# EAGLE design GateRhythm (EAGLE 6.5.0)
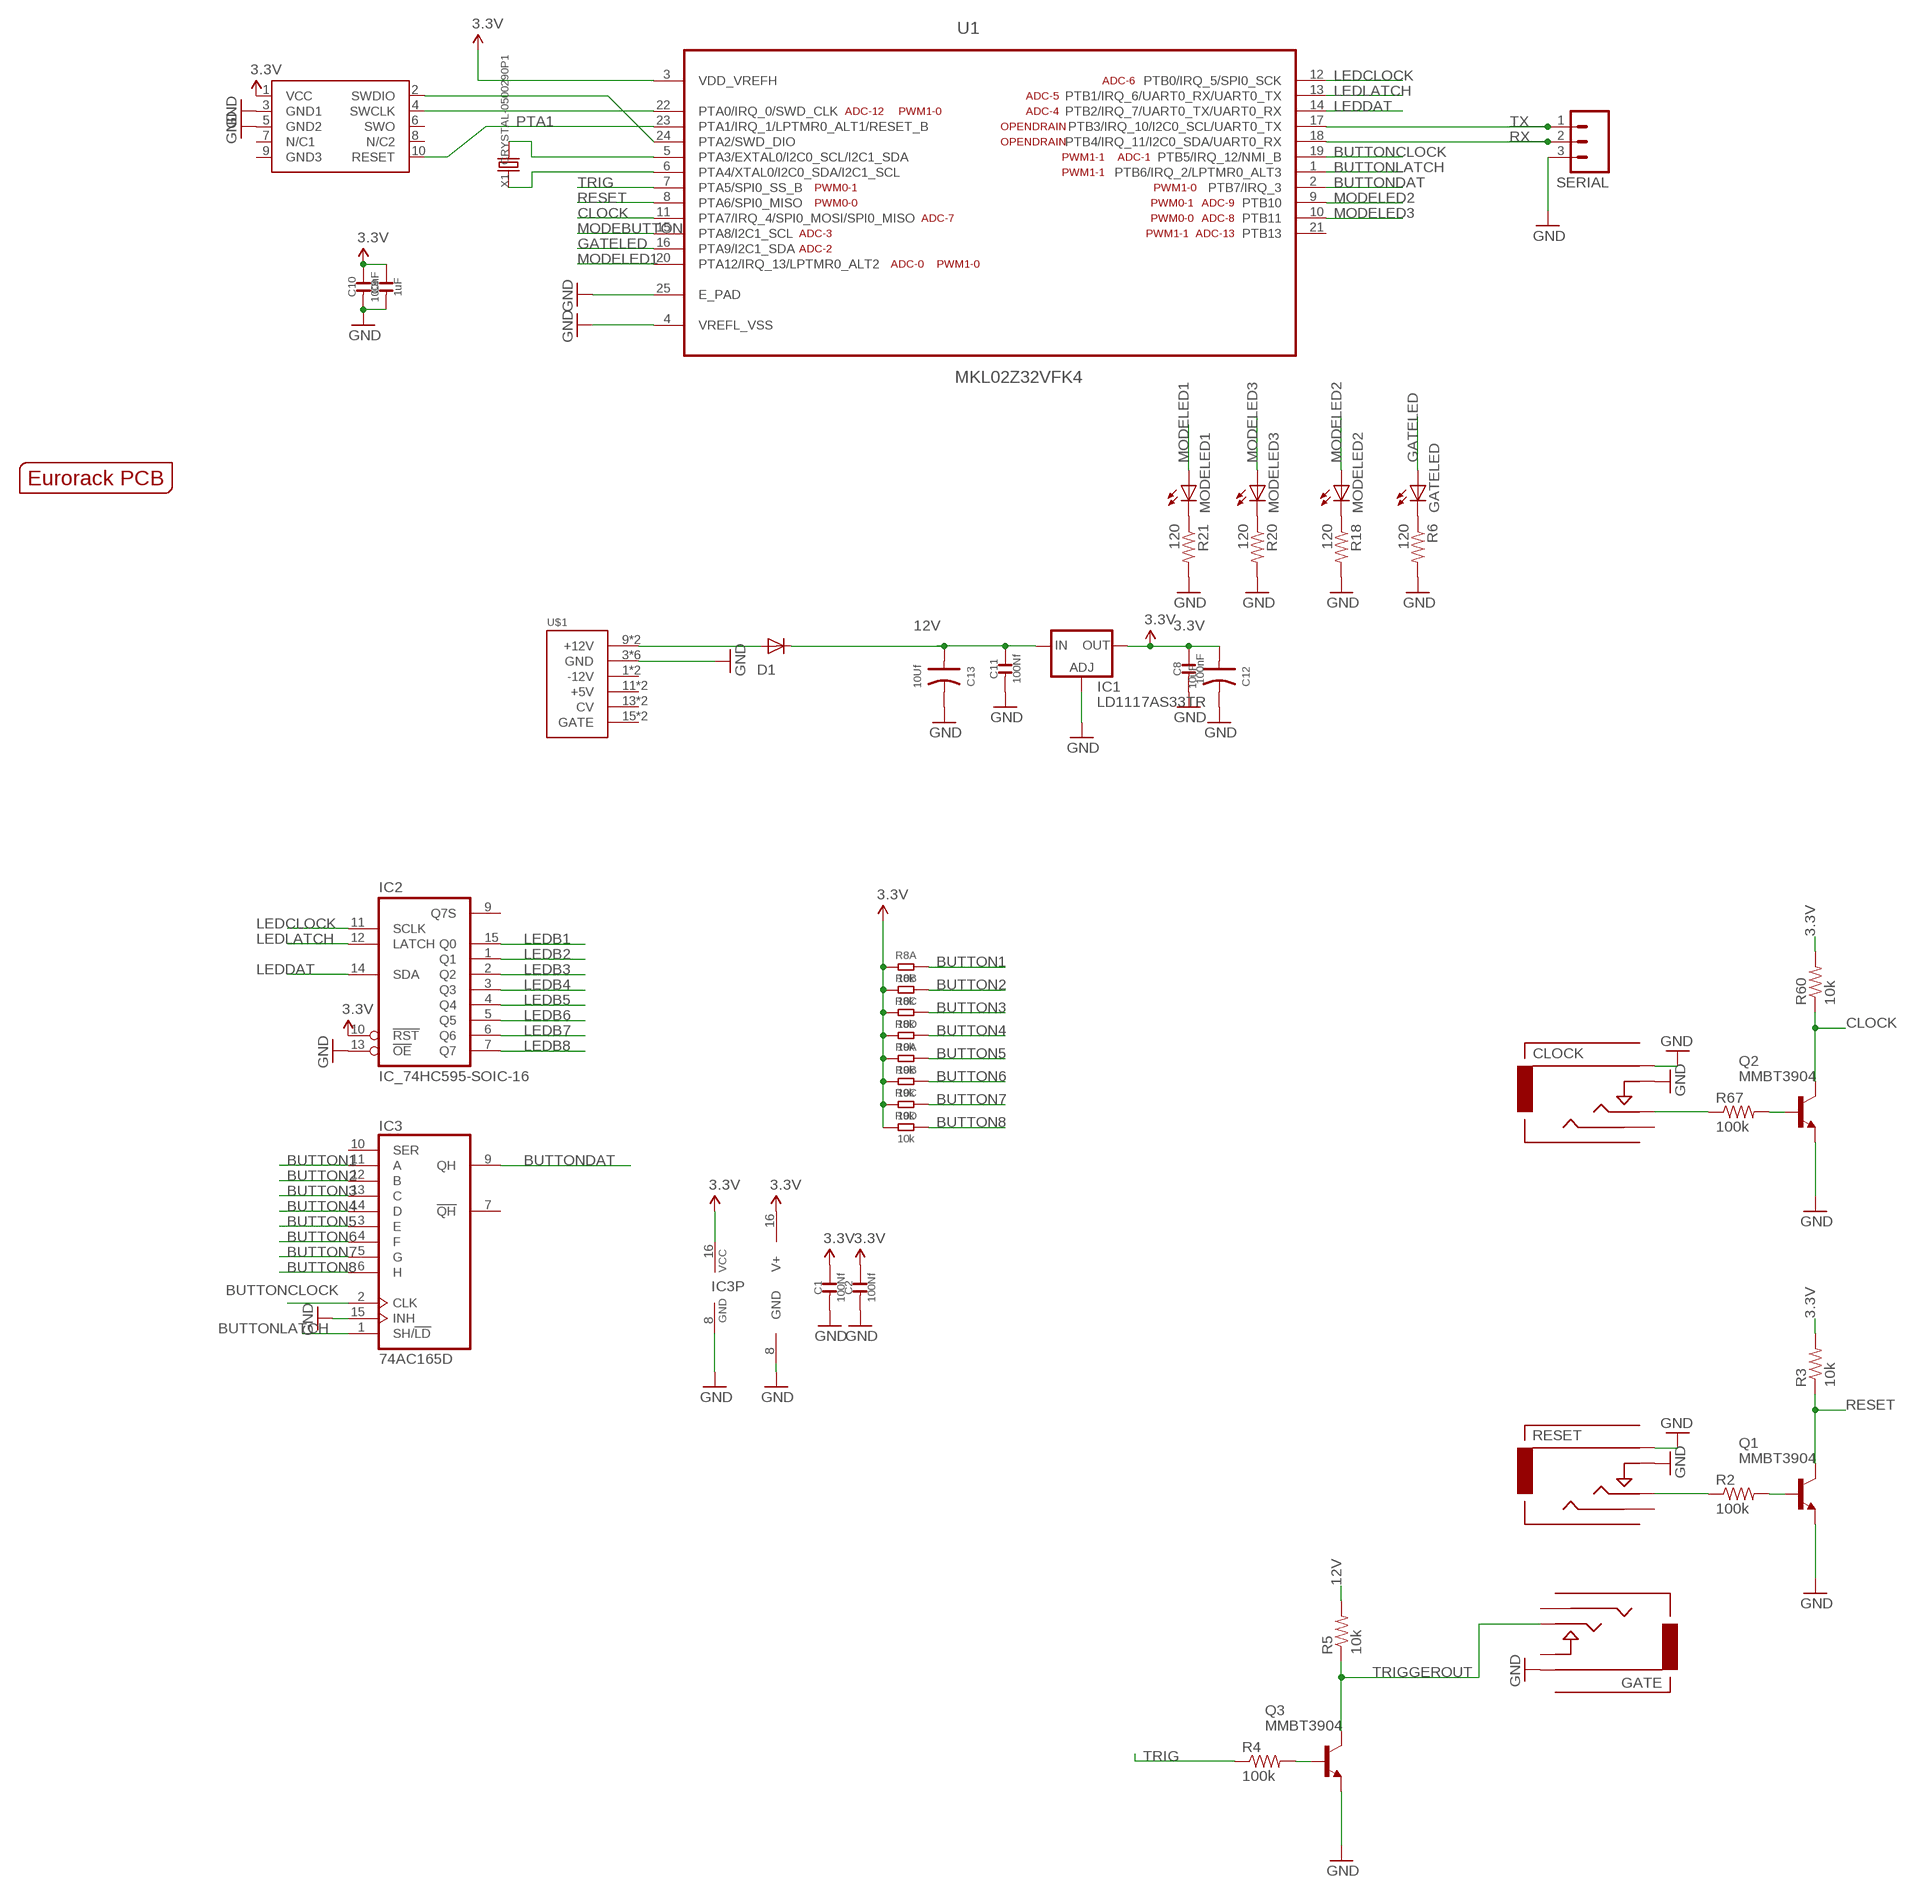
[diagram p0: schematic, sheet 1, part 1 of 2]
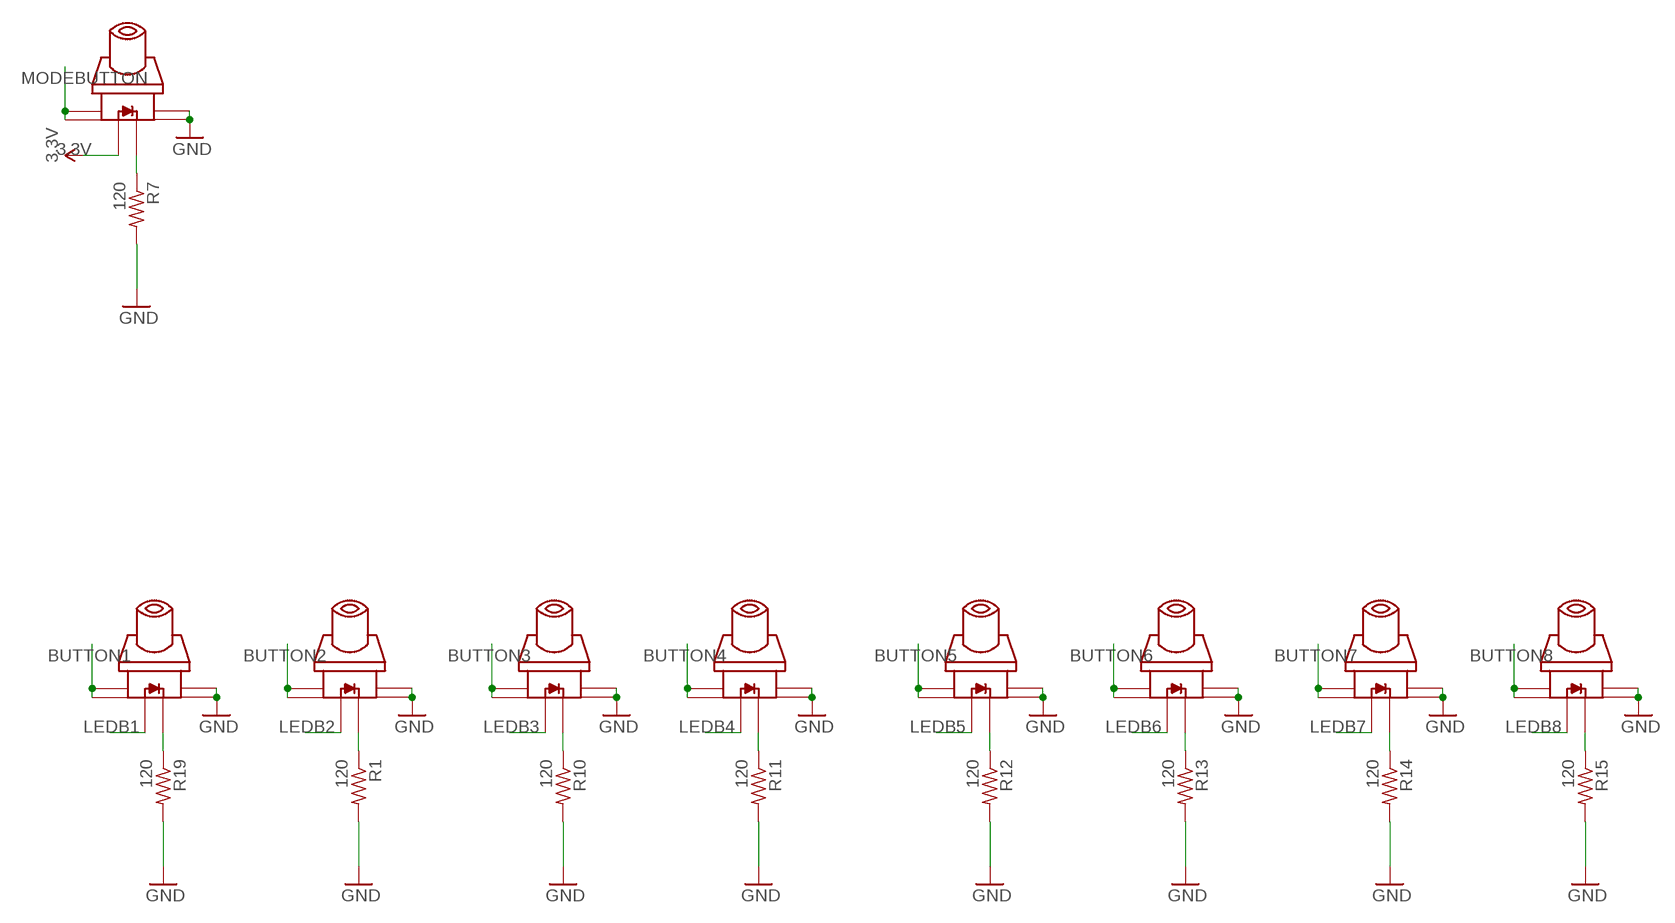
[diagram p1: schematic, sheet 1, part 2 of 2]

## Parts
B1  SWITCH_W_LED_PB6149L-X-102WHITE  [PB6149L]
B2  SWITCH_W_LED_PB6149L-X-102WHITE  [PB6149L]
B3  SWITCH_W_LED_PB6149L-X-102WHITE  [PB6149L]
B4  SWITCH_W_LED_PB6149L-X-102WHITE  [PB6149L]
B5  SWITCH_W_LED_PB6149L-X-102WHITE  [PB6149L]
B6  SWITCH_W_LED_PB6149L-X-102WHITE  [PB6149L]
B7  SWITCH_W_LED_PB6149L-X-102WHITE  [PB6149L]
B8  SWITCH_W_LED_PB6149L-X-102WHITE  [PB6149L]
B9  SWITCH_W_LED_PB6149L-X-102WHITE  [PB6149L]
C1  100Nf  C-0603  [C0603]
C2  100Nf  C-0603  [C0603]
C8  100nF  C-0603  [C0603]
C9  1uF  C-0603  [C0603]
C10  100nF  C-0603  [C0603]
C11  100Nf  C-0603  [C0603]
C12  10uF  C-POLAR-A  [AVX-A]
C13  10Uf  C-POLAR-A  [AVX-A]
CLOCK  Clock  AUDIO-JACKINPUT  [3.5MM-JACK-SWITCH-13MM-INPUT]
D1  1N5819HW  DIODE-SOD123  [SOD123]
GATE  Gate  AUDIO-JACKOUTPUT  [3.5MM-JACK-SWITCH-13MM-OUTPUT]
GATELED  LED3MM  [LED3MM]
IC1  LD1117AS33TR  [SOT223]
IC2  IC_74HC595-SOIC-16  [SOIC-16]
IC3  74AC165D  [SO16]
MODELED1  LED3MM  [LED3MM]
MODELED2  LED3MM  [LED3MM]
MODELED3  LED3MM  [LED3MM]
Q1  MMBT3904  MMBT3904LT1-NPN-SOT23-BEC  [SOT23-BEC]
Q2  MMBT3904  MMBT3904LT1-NPN-SOT23-BEC  [SOT23-BEC]
Q3  MMBT3904  MMBT3904LT1-NPN-SOT23-BEC  [SOT23-BEC]
R1  120  R-US_R0603  [R0603]
R2  100k  R-US_R0603  [R0603]
R3  10k  R-US_R0603  [R0603]
R4  100k  R-US_R0603  [R0603]
R5  10k  R-US_R0603  [R0603]
R6  120  R-US_R0603  [R0603]
R7  120  R-US_R0603  [R0603]
R8  10k  R-4R  [R1206-8]
R9  10k  R-4R  [R1206-8]
R10  120  R-US_R0603  [R0603]
R11  120  R-US_R0603  [R0603]
R12  120  R-US_R0603  [R0603]
R13  120  R-US_R0603  [R0603]
R14  120  R-US_R0603  [R0603]
R15  120  R-US_R0603  [R0603]
R18  120  R-US_R0603  [R0603]
R19  120  R-US_R0603  [R0603]
R20  120  R-US_R0603  [R0603]
R21  120  R-US_R0603  [R0603]
R60  10k  R-US_R0603  [R0603]
R67  100k  R-US_R0603  [R0603]
RESET  Reset  AUDIO-JACKINPUT  [3.5MM-JACK-SWITCH-13MM-INPUT]
SERIAL  M03PTH  [1X03]
SWD1  CORTEX_SWD  [M50-3600542]
U1  MKL02Z32VFK4  [QFN50P400X400X100-25N]
U$1  POWER  [POWER_16]
U$2  EURORACK_PCB6HP  [EURORACK6HPPCB]
X1  CRYSTAL-0500290P1  [2P-SMD-5.0X3.2]

## Nets
3.3V: B9.LEDPOS(POS) C1.2 C2.2 C8.2 C9.2 C10.2 C12.+ IC1.2(OUT) IC1.4(OUT) IC2.10(!RST) IC2.16(V+) IC3.16(VCC) R3.2 R8.1 R8.2 R8.3 R8.4 R9.1 R9.2 R9.3 R9.4 R60.2 SWD1.1(VCC) U1.3(VDD_VREFH)
12V: C11.2 C13.+ D1.C IC1.3(IN) R5.2
BUTTON1: B1.1 B1.2 IC3.11(A) R8.8
BUTTON2: B2.1 B2.2 IC3.12(B) R8.7
BUTTON3: B3.1 B3.2 IC3.13(C) R8.6
BUTTON4: B4.1 B4.2 IC3.14(D) R8.5
BUTTON5: B5.1 B5.2 IC3.3(E) R9.8
BUTTON6: B6.1 B6.2 IC3.4(F) R9.7
BUTTON7: B7.1 B7.2 IC3.5(G) R9.6
BUTTON8: B8.1 B8.2 IC3.6(H) R9.5
BUTTONCLOCK: IC3.2(CLK) U1.19(PTB5/IRQ_12/NMI_B)
BUTTONDAT: IC3.9(QH) U1.2(PTB7/IRQ_3)
BUTTONLATCH: IC3.1(SH/!LD) U1.1(PTB6/IRQ_2/LPTMR0_ALT3)
CLOCK: Q2.C R60.1 U1.11(PTA7/IRQ_4/SPI0_MOSI/SPI0_MISO)
GATELED: GATELED.A U1.16(PTA9/I2C1_SDA)
GND: B1.3 B1.4 B2.3 B2.4 B3.3 B3.4 B4.3 B4.4 B5.3 B5.4 B6.3 B6.4 B7.3 B7.4 B8.3 B8.4 B9.3 B9.4 C1.1 C2.1 C8.1 C9.1 C10.1 C11.1 C12.- C13.- CLOCK.RING@1(RING) CLOCK.RING@2(RING) CLOCK.SWITCH@1(SWITCH) CLOCK.SWITCH@2(SWITCH) GATE.RING@1(RING) GATE.RING@2(RING) IC1.1(ADJ) IC2.8(GND) IC2.13(!OE) IC3.8(GND) IC3.15(INH) Q1.E Q2.E Q3.E R1.2 R6.2 R7.2 R10.2 R11.2 R12.2 R13.2 R14.2 R15.2 R18.2 R19.2 R20.2 R21.2 RESET.RING@1(RING) RESET.RING@2(RING) RESET.SWITCH@1(SWITCH) RESET.SWITCH@2(SWITCH) SERIAL.3 SWD1.3(GND1) SWD1.5(GND2) U1.4(VREFL_VSS) U1.25(E_PAD) U$1.3(GND) U$1.4(GND) U$1.5(GND) U$1.6(GND) U$1.7(GND) U$1.8(GND)
LEDB1: B1.LEDPOS(POS) IC2.15(Q0)
LEDB2: B2.LEDPOS(POS) IC2.1(Q1)
LEDB3: B3.LEDPOS(POS) IC2.2(Q2)
LEDB4: B4.LEDPOS(POS) IC2.3(Q3)
LEDB5: B5.LEDPOS(POS) IC2.4(Q4)
LEDB6: B6.LEDPOS(POS) IC2.5(Q5)
LEDB7: B7.LEDPOS(POS) IC2.6(Q6)
LEDB8: B8.LEDPOS(POS) IC2.7(Q7)
LEDCLOCK: IC2.11(SCLK) U1.12(PTB0/IRQ_5/SPI0_SCK)
LEDDAT: IC2.14(SDA) U1.14(PTB2/IRQ_7/UART0_TX/UART0_RX)
LEDLATCH: IC2.12(LATCH) U1.13(PTB1/IRQ_6/UART0_RX/UART0_TX)
MODEBUTTON: B9.1 B9.2 U1.15(PTA8/I2C1_SCL)
MODELED1: MODELED1.A U1.20(PTA12/IRQ_13/LPTMR0_ALT2)
MODELED2: MODELED2.A U1.9(PTB10)
MODELED3: MODELED3.A U1.10(PTB11)
N$1: U1.5(PTA3/EXTAL0/I2C0_SCL/I2C1_SDA) X1.2
N$2: U1.6(PTA4/XTAL0/I2C0_SDA/I2C1_SCL) X1.1
N$3: B2.LEDNEG(NEG) R1.1
N$4: Q1.B R2.2
N$5: SWD1.4(SWCLK) U1.22(PTA0/IRQ_0/SWD_CLK)
N$6: R2.1 RESET.TIP@1(TIP) RESET.TIP@2(TIP)
N$7: SWD1.2(SWDIO) U1.24(PTA2/SWD_DIO)
N$8: B3.LEDNEG(NEG) R10.1
N$9: Q3.B R4.2
N$10: GATELED.K(C) R6.1
N$11: B9.LEDNEG(NEG) R7.1
N$13: D1.A U$1.9(+12V) U$1.10(+12V)
N$14: B1.LEDNEG(NEG) R19.1
N$15: MODELED2.K(C) R18.1
N$16: MODELED3.K(C) R20.1
N$17: MODELED1.K(C) R21.1
N$19: B4.LEDNEG(NEG) R11.1
N$20: B5.LEDNEG(NEG) R12.1
N$21: B6.LEDNEG(NEG) R13.1
N$22: B7.LEDNEG(NEG) R14.1
N$23: B8.LEDNEG(NEG) R15.1
N$43: CLOCK.TIP@1(TIP) CLOCK.TIP@2(TIP) R67.1
N$66: Q2.B R67.2
PTA1: SWD1.10(RESET) U1.23(PTA1/IRQ_1/LPTMR0_ALT1/RESET_B)
RESET: Q1.C R3.1 U1.8(PTA6/SPI0_MISO)
RX: SERIAL.2 U1.18(PTB4/IRQ_11/I2C0_SDA/UART0_RX)
TRIG: R4.1 U1.7(PTA5/SPI0_SS_B)
TRIGGEROUT: GATE.TIP@1(TIP) GATE.TIP@2(TIP) Q3.C R5.1
TX: SERIAL.1 U1.17(PTB3/IRQ_10/I2C0_SCL/UART0_TX)
Unconnected: CLOCK.SECOND@1(SECOND) CLOCK.SECOND@2(SECOND) GATE.SECOND@1(SECOND) GATE.SECOND@2(SECOND) GATE.SWITCH@1(SWITCH) GATE.SWITCH@2(SWITCH) IC2.9(Q7S) IC3.7(!QH) IC3.10(SER) RESET.SECOND@1(SECOND) RESET.SECOND@2(SECOND) SWD1.6(SWO) SWD1.7(N/C1) SWD1.8(N/C2) SWD1.9(GND3) U1.21(PTB13) U$1.1(-12V) U$1.2(-12V) U$1.11(+5V) U$1.12(+5V) U$1.13(CV) U$1.14(CV) U$1.15(GATE) U$1.16(GATE)

## Library data of the parts
B1-B9 = zephod-components:SWITCH_W_LED_PB6149L-X-102
C1 C2 C8-C11 = OPL:C*
C12 C13 = OPL:C-POLAR*
CLOCK GATE RESET = EurorackModularParts:AUDIO-JACK: Switching Mono 3.5mm Audio Jack from Erthenvar.
D1 = diode:DIODE-: DIODE
GATELED MODELED1-MODELED3 = SparkFun-LED:LED: LEDs Standard schematic elements and footprints for 5mm, 3mm, 1206, and 0603 sized LEDs. 5mm - Spark Fun Electronics SKU : COM-00529 (and others)
IC1 = ld-components:LD1117A?*: Low drop fixed and adjustable positive voltage regulators 1 A Source: http://www.st.com/stonline/products/literature/ds/7194/ld1117axx.pdf
IC2 = dp_devices:IC_74HC595: 8-bit serial-in parallel out shift register, output latch 3-state
IC3 = 74xx-eu:74*165: 8-bit parallel load SHIFT REGISTER
Q1-Q3 = transistor:*-NPN-: NPN Transistror BF959 corrected 2008.03.06
R1-R7 R10-R15 R18-R21 R60 R67 = rcl:R-US_: RESISTOR, American symbol
R8 R9 = OPL:R-4R*: Resistor Array
SERIAL = SparkFun-Connectors:M03: Header 3 Standard 3-pin 0.1" header. Use with straight break away headers (SKU : PRT-00116), right angle break away headers (PRT-00553), swiss pins (PRT-00743), machine pins (PRT-00117), and female headers (PRT-00115). Molex polarized connector foot print use with SKU : PRT-08232 with associated crimp pins and housings.
SWD1 = carrilib with jtags:CORTEX_SWD: .05" Cortex M Connector in SWD mode Manufacturer: Generic Part Number: Cortex M SWD Notes: I use Harwin M50-3600542 connectors
U1 = FarnellThings:MKL02Z32VFK4: IC, MCU, 32BIT, CORTEX M0+, 48MHZ, QFN-24; MPN: MKL02Z32VFK4; OC_FARNELL: 2321481; OC_NEWARK: 61W9887; PACKAGE: QFN-24; SUPPLIER: FREESCALE SEMICONDUCTOR
U$1 = eurorack:POWER
U$2 = EurorackModularParts:EURORACK_PCB
X1 = OPL:CRYSTAL*

## Board
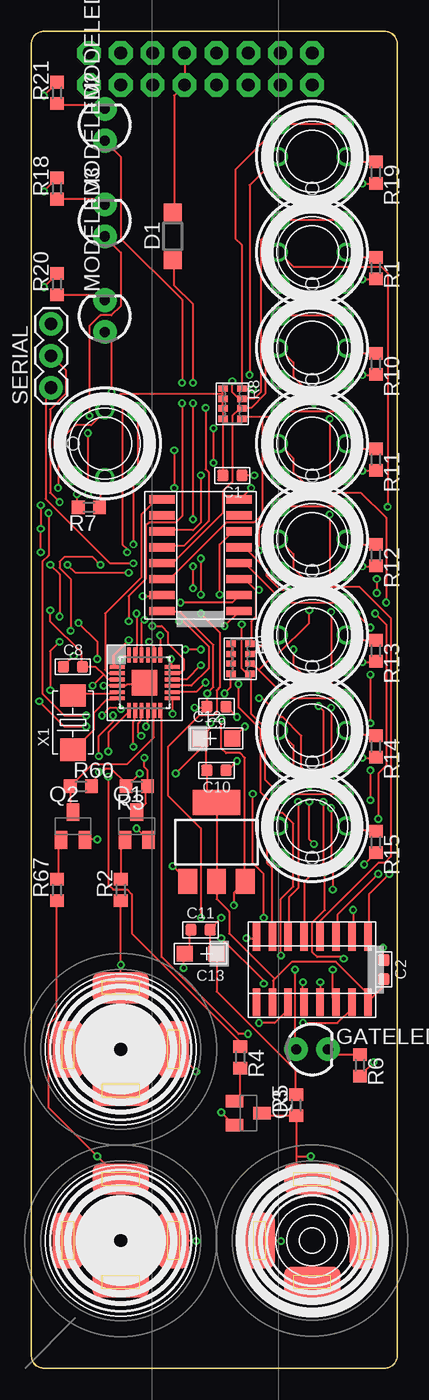
[diagram p2: board, top side]
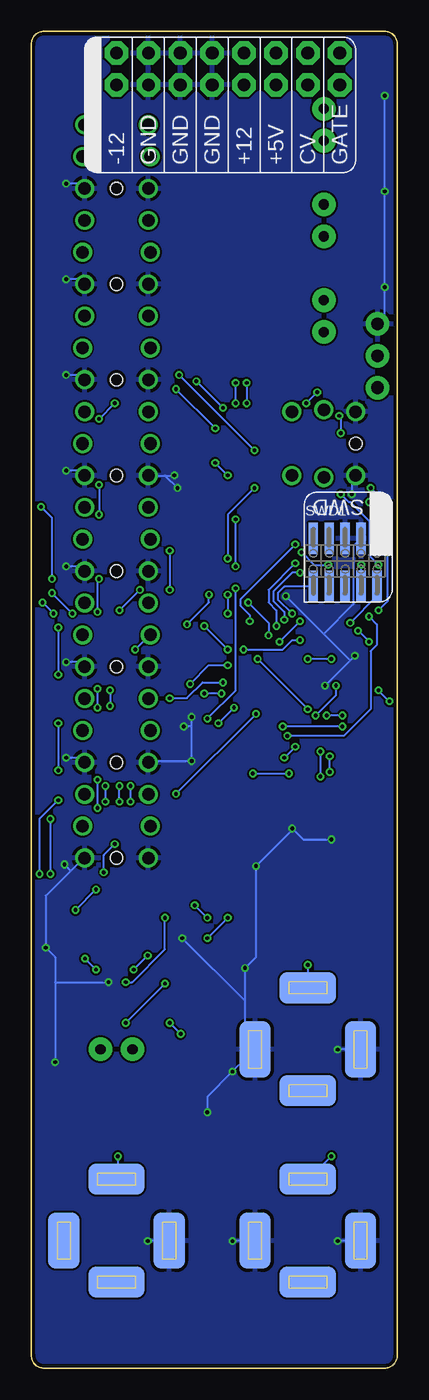
[diagram p3: board, bottom side, seen from below]

Size 29.14 x 106.5 mm. Coordinates in mm from the lower left corner, seen from the top.
Copper layers (1*16): Top 0.035mm / dielectric 1.5mm / Bottom 0.035mm
Design rules "ITEADstudio_DRC": minimum track width 6mil, minimum drill 12mil, track to track 6mil, track to pad 6mil, pad to pad 6mil, via to via 6mil, smd to smd 0mil, copper to edge 10mil, drill to drill 10mil, minimum pad ring 10mil, minimum via ring 6mil, stop-mask expansion 2mil, vias tented up to drill 100mil, thermal gap 10mil

### Footprints (pad centres in the part's own frame; a part is rotated, then mirrored left to right if it is on the bottom)
PB6149L = drill 1: 1 2.54,2.54; 2 2.54,-2.54; 3 -2.54,2.54; 4 -2.54,-2.54; LEDNEG 0,-2.7; LEDPOS 0,2.7 | hole 1: -2.54,0
C0603 = smd 0.889 x 0.889: 1 -0.762,0; 2 0.762,0
AVX-A = smd 1.27 x 1.27: + -1.27,0; - 1.27,0
3.5MM-JACK-SWITCH-13MM-INPUT = smd 2.5 x 4.5: RING@1 -4.2,0; SWITCH@1 4.2,0 | smd 2.5 x 4.5 bottom: RING@2 -4.2,0; SWITCH@2 4.2,0 | smd 4.5 x 2.5: SECOND@1 0,-3.3; TIP@1 0,4.9 | smd 4.5 x 2.5 bottom: SECOND@2 0,-3.3; TIP@2 0,4.9
SOD123 = smd 1.4 x 1.4: A 1.9,0; C -1.9,0
3.5MM-JACK-SWITCH-13MM-OUTPUT = smd 2.5 x 4.5: RING@1 -4.2,0; SWITCH@1 4.2,0 | smd 2.5 x 4.5 bottom: RING@2 -4.2,0; SWITCH@2 4.2,0 | smd 4.5 x 2.5: SECOND@1 0,-3.3; TIP@1 0,4.9 | smd 4.5 x 2.5 bottom: SECOND@2 0,-3.3; TIP@2 0,4.9
LED3MM = drill 0.813 pad 1.88: A -1.27,0; K 1.27,0
SOT223 = smd 1.5 x 2: 1 -2.3,-3.15; 2 0,-3.15; 3 2.3,-3.15 | smd 3.8 x 2: 4 0,3.15
SOIC-16 = smd 0.6 x 2.2: 1 -4.445,-2.6; 2 -3.175,-2.6; 3 -1.905,-2.6; 4 -0.635,-2.6; 5 0.635,-2.6; 6 1.905,-2.6; 7 3.175,-2.6; 8 4.445,-2.6; 9 4.445,2.6; 10 3.175,2.6; 11 1.905,2.6; 12 0.635,2.6; 13 -0.635,2.6; 14 -1.905,2.6; 15 -3.175,2.6; 16 -4.445,2.6
SO16 = smd 0.66 x 2.032: 1 -4.445,-3.073; 2 -3.175,-3.073; 3 -1.905,-3.073; 4 -0.635,-3.073; 5 0.635,-3.073; 6 1.905,-3.073; 7 3.175,-3.073; 8 4.445,-3.073; 9 4.445,3.073; 10 3.175,3.073; 11 1.905,3.073; 12 0.635,3.073; 13 -0.635,3.073; 14 -1.905,3.073; 15 -3.175,3.073; 16 -4.445,3.073
SOT23-BEC = smd 1 x 1.4: B -0.95,-1.1; C 0,1.1; E 0.95,-1.1
R0603 = smd 1 x 1.1: 1 -0.85,0; 2 0.85,0
R1206-8 = smd 0.508 x 0.762: 1 -1.206,-0.762; 2 -0.381,-0.762; 3 0.381,-0.762; 4 1.206,-0.762; 5 1.206,0.762; 6 0.381,0.762; 7 -0.381,0.762; 8 -1.206,0.762
1X03 = drill 1.016 pad 1.88: 1 0,0; 2 2.54,0; 3 5.08,0
M50-3600542 = smd 0.75 x 2.5: 1 -2.54,-1.81; 2 -2.54,2; 3 -1.27,-1.81; 4 -1.27,2; 5 0,-1.81; 6 0,2; 7 1.27,-1.81; 8 1.27,2; 9 2.54,-1.81; 10 2.54,2
QFN50P400X400X100-25N = smd 1.2 x 0.3: 1 -2.2,1.245; 2 -2.2,0.762; 3 -2.2,0.254; 4 -2.2,-0.254; 5 -2.2,-0.762; 6 -2.2,-1.245; 13 2.2,-1.245; 14 2.2,-0.762; 15 2.2,-0.254; 16 2.2,0.254; 17 2.2,0.762; 18 2.2,1.245 | smd 0.3 x 1.2: 7 -1.245,-2.2; 8 -0.762,-2.2; 9 -0.254,-2.2; 10 0.254,-2.2; 11 0.762,-2.2; 12 1.245,-2.2; 19 1.245,2.2; 20 0.762,2.2; 21 0.254,2.2; 22 -0.254,2.2 | smd 0.305 x 1.2: 23 -0.762,2.2; 24 -1.245,2.2 | smd 2.032 x 2.032: 25 0,0
POWER_16 = drill 1.016 pad 1.88 octagon: 1 -6.35,-1.27; 2 -6.35,1.27; 3 -3.81,-1.27; 4 -3.81,1.27; 5 -1.27,-1.27; 6 -1.27,1.27; 7 1.27,-1.27; 8 1.27,1.27; 9 3.81,-1.27; 10 3.81,1.27; 11 6.35,-1.27; 12 6.35,1.27; 13 8.89,-1.27; 14 8.89,1.27; 15 11.43,-1.27; 16 11.43,1.27
2P-SMD-5.0X3.2 = smd 1.778 x 2.032: 1 -2.159,0; 2 2.159,0

### Placement (x,y rotation side)
B1  22.36,96.52 90 top
B2  22.36,88.9 90 top
B3  22.36,81.28 90 top
B4  22.36,73.66 90 top
B5  22.36,66.04 90 top
B6  22.36,58.42 90 top
B7  22.36,50.8 90 top
B8  22.36,43.18 90 top
B9  5.85,73.66 0 top
C1  16.01,71.12 180 top
C2  28.07,31.75 270 top
C8  3.31,55.88 0 top
C9  14.74,52.7 180 top
C10  14.74,47.62 180 top
C11  13.47,34.92 0 top
C12  14.74,50.16 0 top
C13  13.47,33.02 180 top
CLOCK  7.12,10.16 0 top
D1  11.26,90.17 90 top
GATE  22.36,10.16 0 top
GATELED  22.36,25.4 0 top
IC1  14.74,41.91 0 top
IC2  22.36,31.75 180 top
IC3  13.47,64.77 90 top
MODELED1  5.85,99.06 90 top
MODELED2  5.85,91.44 90 top
MODELED3  5.85,83.82 90 top
Q1  8.39,43.18 0 top
Q2  3.31,43.18 0 top
Q3  17.28,20.32 270 top
R1  27.44,87.63 270 top
R2  7.12,38.1 90 top
R3  8.39,46.35 180 top
R4  16.64,24.77 270 top
R5  21.09,20.95 90 top
R6  26.17,24.13 270 top
R7  4.58,68.58 180 top
R8  16.01,76.83 270 top
R9  16.64,56.52 270 top
R10  27.44,80.01 270 top
R11  27.44,72.39 270 top
R12  27.44,64.77 270 top
R13  27.44,57.15 270 top
R14  27.44,49.53 270 top
R15  27.44,41.91 270 top
R18  2.04,93.98 90 top
R19  27.44,95.25 270 top
R20  2.04,86.36 90 top
R21  2.04,101.6 90 top
R60  3.95,46.35 0 top
R67  2.04,38.1 90 top
RESET  7.12,25.4 0 top
SERIAL  1.57,78.11 90 top
SWD1  4.15,64.29 180 bottom
U1  9.03,54.61 0 top
U$1  16.01,103.5 0 bottom
U$2  -0.5,0 0 top
X1  3.31,51.44 90 top

### Tracks (layer width: path | path; a pad name or v marks a point on that pad's centre or on a via)
3.3V  (via drill 0.3)
  Top 0.152: 15.25,77.62 15.25,77.25 R8.2 15.25,77.12 15.25,76.5 R8.3 15.25,76.38 15.25,75.75 R8.4 C1.2 | 15.25,77.62 15.25,78 R8.1 | v0.75,68.75 v0.75,66.88 v0.75,65 | v2.12,70.12 2.12,73.75 3.5,75.12 4.75,75.12 5.88,76.25 B9.LEDPOS 5.88,76.38 7.12,77.62 15.25,77.62 | 5.75,55.25 6.12,54.88 6.75,54.88 U1.3 | 5.75,55.25 5.12,55.88 4.12,55.88 C8.2 4,56 4,57 1.5,59.5 v1.5,60.38 | 5.5,47.38 5.88,47.75 6.38,47.75 7.5,46.62 7.5,46.38 R3.2 7.62,46.38 v8.62,47.38 | 5.5,47.38 4.88,46.75 4.88,46.38 R60.2 | R9.1 16,57.62 16,57 R9.2 16,56.88 16,56.25 R9.3 16,56.12 16,55.38 R9.4 15.88,55.25 15.88,54.25 v15.38,53.75 | 13.88,49.75 13.88,47.62 C10.2 14,47.5 14,45.75 14.62,45.12 IC1.4 14.75,45 14.75,38.88 IC1.2 14.75,37.38 15.75,36.38 15.75,34.62 19.38,31 | 13.88,49.75 13.5,50.12 C12.+ | v13,52.62 13.88,52.62 C9.2 14,52.75 v14,53.75 14.5,54.25 14.5,57.62 11.88,60.25 10.5,60.25 IC3.16 | v14.25,51.38 14.25,51 13.5,50.25 C12.+ | 13.88,49.75 v11.5,47.38 | 13.88,49.75 C12.+ | v4.88,54.38 5.75,55.25 | v6.5,52 6.5,51.5 5.38,50.38 v5.38,48.75 | 5.5,47.38 v5.38,47.5 | 27.12,29.5 26.88,29.25 IC2.16 | 27.12,29.5 28,30.38 28,30.88 C2.2 | 19.38,31 20.75,32.38 24.25,32.38 27.12,29.5 | 19.38,31 19.25,30.88 19.25,29.25 IC2.10
  Bottom 0.152: v0.75,66.88 1.5,66.12 SWD1.1 | v2.12,70.12 v0.75,68.75 | v14.25,51.38 v13,52.62 | v14,53.75 v15.38,53.75 | v11.5,47.38 v8.62,47.38 | v4.88,54.38 4.88,53.62 v6.5,52 | v5.38,47.5 v5.38,48.75 | v0.75,65 0.75,61.12 v1.5,60.38
12V  (via drill 0.3)
  Top 0.152: R5.2 21,21.88 21,23.75 14.75,30 14.75,33 C13.+ 14.62,33.12 14.25,33.5 14.25,34.88 C11.2 14.25,35 v15.12,35.88 | v12.88,78.5 12.88,84.75 11.38,86.25 11.38,88.25 D1.C | v12.88,67.62 v12.88,76.88 | v12.88,62.12 v12.88,63.88 | v15.12,51.75 15.12,49.38 15.5,49 16.62,49 17,48.62 17,38.88 IC1.3 17,38.75 16.12,37.88 v16.12,36.88
  Bottom 0.152: v12.88,76.88 v12.88,78.5 | v12.88,63.88 v12.88,67.62 | v12.88,62.12 12.88,54 v15.12,51.75 | v16.12,36.88 v15.12,35.88
BUTTON1  (via drill 0.3)
  Top 0.152: v13.5,71.12 13.5,67.38 12.88,66.75 10.5,66.75 IC3.11 | v14.5,74.88 v14.5,72.12 | v17.62,78 16.88,78 R8.8 16.75,78.12 16.75,89.5 16.25,90 16.25,95.5 19.75,99 B1.1 19.88,99.12 24.88,99.12 B1.2
  Bottom 0.152: v14.5,72.12 v13.5,71.12 | v17.62,78 v14.5,74.88
BUTTON2  (via drill 0.3)
  Top 0.152: v13.88,76.5 13.88,71.62 14.12,71.38 14.12,67.5 12.12,65.5 10.5,65.5 IC3.12 | v16,78.62 16,77.75 16.5,77.25 16.75,77.25 R8.7 16.88,77.25 17.75,77.25 18.25,77.75 18.25,89.88 19.75,91.38 B2.1 19.88,91.5 24.88,91.5 B2.2
  Bottom 0.152: v16,78.62 v13.88,76.5
BUTTON3
  Top 0.152: IC3.13 10.5,64.25 11.38,64.25 15.25,68.12 15.25,69.88 16,70.62 16,75.88 16.5,76.38 16.75,76.38 R8.6 16.88,76.5 17.5,76.5 18.62,77.62 18.62,82.62 B3.1 19.88,83.88 24.88,83.88 B3.2
BUTTON4
  Top 0.152: 18.38,75.75 19.38,75.75 19.75,76.12 B4.1 19.88,76.25 24.88,76.25 B4.2 | 18.38,75.75 16.88,75.75 R8.5 | 18.38,75.75 18.38,68 17.75,67.38 15.5,67.38 11,62.88 10.5,62.88 IC3.14
BUTTON5  (via drill 0.3)
  Top 0.152: 17.88,62 17.88,59.88 17.5,59.5 17.5,57.75 R9.8 | 17.88,62 17.12,62.75 16.62,62.75 IC3.3 | B5.2 24.88,68.62 19.88,68.62 B5.1 19.75,68.5 18.12,66.88 v18.12,65.12 | v18.12,62 17.88,62
  Bottom 0.152: v18.12,65.12 v18.12,62
BUTTON6
  Top 0.152: R9.7 17.5,57 17.75,57 18.62,57.88 18.62,59.75 19.75,60.88 B6.1 | IC3.4 16.62,64.12 17,64.12 19.75,61.38 19.75,61 B6.1 | B6.2 24.88,61 19.88,61 B6.1
BUTTON7  (via drill 0.3)
  Top 0.152: 18.12,55.62 19.75,54 19.75,53.38 B7.1 19.88,53.38 24.88,53.38 B7.2 | 18.12,55.62 17.88,55.88 17.75,55.88 17.5,56.12 R9.6 | v20.5,62 19.88,62 18.75,63.12 18.75,63.62 17,65.38 16.62,65.38 IC3.5 | v22.12,60.38 22.12,59.38 19.62,56.88 19.38,56.88 18.12,55.62
  Bottom 0.152: v22.12,60.38 v20.5,62
BUTTON8  (via drill 0.3)
  Top 0.152: 17.5,55 17.5,52.12 18.62,51 18.62,46.88 19.75,45.75 B8.1 19.88,45.75 24.88,45.75 B8.2 | 17.5,55 17.5,55.25 R9.5 | v15,61.62 15,65.62 16,66.62 16.5,66.62 IC3.6 | v16.75,59.25 16.75,55.75 17.5,55
  Bottom 0.152: v15,61.62 15,61 v16.75,59.25
BUTTONCLOCK  (via drill 0.3)
  Top 0.152: v10.25,58.38 10.25,56.88 U1.19 | v11.88,61 16,61 16.5,61.5 IC3.2
  Bottom 0.152: v10.25,58.38 10.25,59.38 v11.88,61
BUTTONDAT
  Top 0.152: U1.2 6.75,55.38 6.12,55.38 5.88,55.62 5.88,60.12 8.75,63 8.75,68 9.88,69.12 10.38,69.12 IC3.9
BUTTONLATCH  (via drill 0.3)
  Top 0.152: v7.75,58 6.5,56.75 6.5,56.12 6.75,55.88 U1.1 | v13.5,57.25 v12.25,57.25 | v15.38,59.12 16.5,60.25 IC3.1
  Bottom 0.152: v7.75,58 8.38,58 9.12,57.25 v12.25,57.25 | v15.38,59.12 v13.5,57.25
CLOCK
  Top 0.152: Q2.C 3.25,44.38 3.12,44.5 3.12,46.25 R60.1 3.12,46.38 4.88,48.12 7.62,48.12 9.75,50.25 9.75,52.38 U1.11
GATELED  (via drill 0.3)
  Top 0.152: v13.5,56 12.38,54.88 11.25,54.88 U1.16 | v16.5,54.5 16.5,52.62 18.25,50.88 18.25,45.88 19.88,44.25 20,44.25 20.88,43.38 20.88,38.38 19.88,37.38 v19.88,32.88 | v21,31.75 21,25.5 GATELED.A
  Bottom 0.152: v13.5,56 15,56 v16.5,54.5 | v21,31.75 v19.88,32.88
GND  (via drill 0.3)
  Top 0.152: v3.38,56.75 2.62,56 C8.1 | v5.75,54.38 6.75,54.38 U1.4 6.88,54.38 7.5,54.38 7.62,54.5 9,54.5 U1.25 | v8.88,61.5 10.38,61.5 IC3.15 | v5.25,42.12 4.38,42.12 Q2.E | v8.38,43 9.25,42.12 Q1.E | v11.25,40 12.38,38.88 IC1.1 | C11.1 12.62,34.88 12.62,33.5 12.25,33.12 C13.- 12.12,33 v12.12,31.88 | v16.38,48.38 15.62,47.62 C10.1 | v16.38,51.88 15.62,52.62 C9.1 | v17.75,71.12 16.88,71.12 C1.1 | v28,33.5 28,32.62 C2.1 | v3.62,69.62 3.62,68.62 R7.2 | v27.25,24.38 26.25,23.38 R6.2 | v26.5,40.12 27.38,41 R15.2 | v26.38,48.62 27.38,48.62 R14.2 | v26.38,56.25 27.38,56.25 R13.2 | v1,86.12 2,87.12 R20.2 | v26.38,63.88 27.38,63.88 R12.2 | v1,93.75 2,94.75 R18.2 | v26.38,71.5 27.38,71.5 R11.2 | v1,101.38 2,102.38 R21.2 | v26.38,79.12 27.38,79.12 R10.2 | v26.38,86.75 27.38,86.75 R1.2 | v26.38,94.38 27.38,94.38 R19.2 | v17,51.12 16.12,50.25 C12.- | v15.12,20.38 16.12,19.38 Q3.E | v17.5,70.12 16.62,69.25 IC3.8 | v23,30.75 23,29.25 IC2.13 | v17.12,34.25 17.88,34.25 IC2.8 | v4.75,10.12 3,10.12 CLOCK.RING@2 | v13.12,10.12 11.38,10.12 CLOCK.SWITCH@2 | v4.75,25.38 3,25.38 RESET.RING@2 | v19.88,10.12 18.25,10.12 GATE.RING@2 | v13.12,23.62 11.38,25.38 RESET.SWITCH@2
  Bottom 0.152: v5.75,54.38 3.75,56.38 | 3.75,56.38 v3.38,56.75 | 3.75,56.38 5.88,58.5 | 5.88,58.5 v8.88,61.5 | v5.25,42.12 7.5,42.12 8.25,42.88 | 8.25,42.88 8.38,42.88 v11.25,40 11.25,32.75 v12.12,31.88 12.12,29.25 | 8.25,42.88 v8.38,43 | B7.3 19.75,48.38 v16.38,48.38 16.38,51.12 | 16.38,51.12 v16.38,51.88 | 18.5,71.12 19.75,71.12 B4.3 | 18.5,71.12 v17.75,71.12 | 26,39.62 25,40.62 B8.4 | 26,39.62 28,37.62 v28,33.5 27.25,32.75 27.25,30.75 | v3.62,69.62 3.62,70.75 3.38,71 B9.4 | 27.25,30.75 v27.25,24.38 | 26,39.62 v26.5,40.12 | v26.38,48.62 25.25,48.62 25,48.38 B7.4 | v26.38,56.25 25.25,56.25 25,56 B6.4 | SERIAL.3 1.5,83.25 1,83.75 v1,86.12 v1,93.75 v1,101.38 | v26.38,63.88 25.38,63.88 25,63.5 B5.4 | v26.38,71.5 25.38,71.5 25,71.12 B4.4 | v26.38,79.12 25.38,79.12 25,78.75 B3.4 | v26.38,86.75 25.38,86.75 25,86.38 B2.4 | v26.38,94.38 25.38,94.38 25,94 B1.4 | 16.38,51.12 v17,51.12 | v15.12,20.38 15.12,21.62 v13.12,23.62 12.12,24.62 | 12.12,24.62 11.38,25.38 RESET.SWITCH@2 12.12,24.62 | 12.12,24.62 12.12,29.25 | 18.5,71.12 v17.5,70.12 | 27.25,30.75 v23,30.75 | 12.12,29.25 v17.12,34.25 | v4.75,10.12 3,10.12 CLOCK.RING@2 | v13.12,10.12 11.38,10.12 CLOCK.SWITCH@2 | v4.75,25.38 3,25.38 RESET.RING@2 | v19.88,10.12 18.25,10.12 GATE.RING@2 | 5.88,58.5 3.5,60.88 3.5,65.5 3,66 SWD1.3
  pour Bottom: -1.14,108.58 30.61,108.58 30.61,-2.54 -1.14,-2.54
LEDB1  (via drill 0.3)
  Top 0.152: v21.62,27.5 24.38,27.5 25.5,28.62 25.5,29.12 IC2.15 | v18.5,30.62 18.5,30.88 v15.12,34.25 | v13.5,35.88 13.5,43 10.88,45.62 10.88,49.5 13.38,52 14.5,52 14.75,52.25 14.75,54 15,54.25 15,58.62 v13.5,60.12 | v13.5,64.5 v13.5,61.62 | v11.38,73.12 v11.38,70.12 | v17.38,79.12 17.38,94.25 19.62,96.5 B1.LEDPOS
  Bottom 0.152: v18.5,30.62 v21.62,27.5 | v13.5,35.88 v15.12,34.25 | v13.5,61.62 v13.5,60.12 | v13.5,64.5 13.5,68 v11.38,70.12 | v17.38,79.12 v11.38,73.12
LEDB2  (via drill 0.3)
  Top 0.152: v28.5,39.38 26.88,37.75 26.88,34.38 IC2.1 | v27,47.62 v27,45.25 | v27,55.25 v27,51.38 | v25.88,60.12 v27,59 | v27.5,62.88 v27.5,61.75 | v28.38,68.62 28.38,87.25 27.88,87.75 20.88,87.75 19.75,88.88 B2.LEDPOS
  Bottom 0.152: v28.5,39.38 28.5,43.75 v27,45.25 | v27,51.38 v27,47.62 | v27,59 v27,55.25 | v27.5,61.75 v25.88,60.12 | v27.5,62.88 27.5,67.75 v28.38,68.62
LEDB3  (via drill 0.3)
  Top 0.152: v25.62,36.5 25.62,34.38 IC2.2 | v24,38.12 24,40.12 23.88,40.25 v23.88,44.62 | v23.88,52.62 v23.88,46.88 | v23.88,60.25 v23.88,54.12 | v23.75,68 v23.75,62.88 | v23.75,75.62 v23.75,70.38 | v22.5,76.88 22.5,77.38 20.88,79 20.88,80.12 19.75,81.25 B3.LEDPOS
  Bottom 0.152: v24,38.12 v25.62,36.5 | v23.88,46.88 v23.88,44.62 | v23.88,54.12 v23.88,52.62 | v23.88,60.25 23.88,62.75 v23.75,62.88 | v23.75,70.38 v23.75,68 | v22.5,76.88 v23.75,75.62
LEDB4  (via drill 0.3)
  Top 0.152: v27.62,39.38 24.38,36.12 24.38,34.38 IC2.3 | v27.62,43.75 27.62,47.38 28.25,48 28.25,59.25 v27.38,60.12 | v28.25,61 28.25,67.75 26.25,69.75 22.5,69.75 20.88,71.38 20.88,72.5 19.75,73.62 B4.LEDPOS
  Bottom 0.152: v27.62,43.75 v27.62,39.38 | v28.25,61 v27.38,60.12
LEDB5
  Top 0.152: IC2.4 23,34.38 23,35.62 27.62,40.25 28.12,40.25 28.62,40.75 28.62,59.75 26.12,62.25 22.38,62.25 20.88,63.75 20.88,64.88 19.75,66 B5.LEDPOS
LEDB6  (via drill 0.3)
  Top 0.152: v23.25,45.12 23.25,40.25 21.75,38.75 21.75,34.38 IC2.5 | v23.25,46.38 23.25,52.38 v22.88,52.75 | v22.88,54 20.88,56 v20.88,57.25
  Bottom 0.152: v23.25,46.38 v23.25,45.12 | v22.88,54 v22.88,52.75 | v20.88,57.25 19.75,58.38 B6.LEDPOS
LEDB7  (via drill 0.3)
  Top 0.152: v21.25,45.12 21.25,38.25 20.5,37.5 20.5,34.38 IC2.6 | v21.25,46.38 21.25,47.62 20.88,48 20.88,49.62 19.75,50.75 B7.LEDPOS
  Bottom 0.152: v21.25,46.38 v21.25,45.12
LEDB8
  Top 0.152: IC2.7 19.12,34.38 19.12,39.88 18.75,40.25 18.75,42.25 19.62,43.12 B8.LEDPOS
LEDCLOCK  (via drill 0.3)
  Top 0.152: v17.25,26.62 16.5,26.62 10.38,32.75 10.38,52.38 U1.12 | v18.12,27.5 19.38,27.5 20.38,28.5 20.38,29.12 IC2.11
  Bottom 0.152: v18.12,27.5 v17.25,26.62
LEDDAT  (via drill 0.3)
  Top 0.152: v13.88,54.62 13.12,53.88 11.25,53.88 U1.14 | v18.12,53.38 18.38,53.38 19.88,51.88 20,51.88 21.5,50.38 21.5,47.88 22.12,47.25 v22.12,46.38 | v22.12,45.12 22.12,42.12 v22.5,41.75 | v23.38,39.5 23.38,36.5 22.38,35.5 22.38,33.12 22.75,32.75 24.75,32.75 v24.88,32.62 | v24,31.75 24,29.5 24.25,29.25 IC2.14
  Bottom 0.152: v13.88,54.62 15.5,54.62 16.75,53.38 v18.12,53.38 | v22.12,45.12 v22.12,46.38 | v22.5,41.75 23.38,40.88 v23.38,39.5 | v24,31.75 v24.88,32.62
LEDLATCH  (via drill 0.3)
  Top 0.152: v11.25,52.12 11.25,53.25 U1.13 | v17.62,45.75 17.62,40.25 18.5,39.38 v18.5,35.88 | v21.62,30.75 21.62,29.25 IC2.12
  Bottom 0.152: v17.62,45.75 v11.25,52.12 | v18.5,35.88 18.5,33.38 21.12,30.75 v21.62,30.75
MODEBUTTON  (via drill 0.3)
  Top 0.152: v11.75,59.5 12.12,59.5 14.12,57.5 14.12,55.75 12.75,54.38 11.25,54.38 U1.15 | v8.12,65.62 8.12,70.75 8.38,71 B9.2 8.5,71.12 8.5,76.12 B9.1
  Bottom 0.152: v11.75,59.5 11.75,60 12.5,60.75 12.5,61.25 v8.12,65.62
MODELED1  (via drill 0.3)
  Top 0.152: v9.38,57.88 9.75,57.5 9.75,56.88 U1.20 | v7.75,59.5 7.75,61.5 9.12,62.88 9.12,67.12 9.38,67.38 11.5,67.38 12,67.88 v12,76.88 | v12,78.5 12,85.12 7.12,90 7.12,96.5 5.88,97.75 MODELED1.A
  Bottom 0.152: v7.75,59.5 v9.38,57.88 | v12,78.5 v12,76.88
MODELED2  (via drill 0.3)
  Top 0.152: v8.75,50.38 8.5,50.62 8.5,51.38 8.75,51.62 8.75,52.38 U1.9 | v2.25,59.88 2.25,63.25 v1.5,64 | v4.5,74.5 v4.5,69.62 | v4.62,75.88 4.62,83 5.5,83.88 6.38,83.88 7.12,84.62 7.12,88.88 5.88,90.12 MODELED2.A
  Bottom 0.152: v8.75,50.38 4.25,50.38 2.12,52.5 2.12,57.12 1.62,57.62 1.62,59.25 v2.25,59.88 | v1.5,64 2.25,64.75 2.25,67.5 3.75,69 3.88,69 v4.5,69.62 | v4.5,74.5 4.5,75.75 v4.62,75.88
MODELED3  (via drill 0.3)
  Top 0.152: v9.12,51.12 9.25,51.25 9.25,52.38 U1.10 | v4.38,51.12 2.62,51.12 v0.62,53.12 | v1.5,54 1.5,57.12 v2.25,57.88 | v3.12,58.75 3.12,62.88 2.25,63.75 2.25,64.25 2.62,64.62 4.88,64.62 v5.5,64 | v7.62,65 7.62,65.25 7.25,65.62 v7.25,76.88 | v6.38,77.75 6.38,82 5.88,82.5 MODELED3.A
  Bottom 0.152: v4.38,51.12 v9.12,51.12 | v1.5,54 v0.62,53.12 | v3.12,58.75 v2.25,57.88 | v5.5,64 6.62,64 v7.62,65 | v6.38,77.75 v7.25,76.88
N$1
  Top 0.152: U1.5 6.75,53.75 3.5,53.75 3.38,53.62 X1.2
N$2
  Top 0.152: U1.6 6.75,53.25 6,53.25 5,52.25 5,50.88 3.38,49.25 X1.1
N$3
  Top 0.152: R1.1 27.38,88.5 25.5,88.5 25.12,88.88 B2.LEDNEG
N$4
  Top 0.152: R2.2 7.12,39 7.12,41.75 7.38,42 Q1.B
N$5  (via drill 0.3)
  Top 0.152: v9,59.62 8.75,59.38 8.75,56.88 U1.22 | v7.75,63.38 3.5,63.38 v2.88,64
  Bottom 0.152: v9,59.62 9,60.25 9.88,61.12 9.88,61.88 8.38,63.38 v7.75,63.38 | v2.88,64 2.88,62.38 SWD1.4
N$6  (via drill 0.3)
  Top 0.152: R2.1 7.12,37.12 v7.12,32.12 7.12,30.38 RESET.TIP@2
  Bottom 0.152: v7.12,32.12 7.12,30.38 RESET.TIP@2
N$7  (via drill 0.3)
  Top 0.152: v7.12,56.5 7.38,56.75 7.75,56.75 U1.24 | v5.25,56.5 5.25,57.88 v3.75,59.38
  Bottom 0.152: v5.25,56.5 v7.12,56.5 | v3.75,59.38 1.62,61.5 1.62,62.25 SWD1.2
N$8
  Top 0.152: R10.1 27.38,80.88 25.5,80.88 25.12,81.25 B3.LEDNEG
N$9
  Top 0.152: R4.2 16.62,23.88 16.62,21.75 16.25,21.38 Q3.B
N$10
  Top 0.152: R6.1 26.12,25 24.12,25 23.75,25.38 GATELED.K
N$11
  Top 0.152: R7.1 5.5,68.62 5.5,70.62 5.75,70.88 B9.LEDNEG
N$13
  Top 0.152: D1.A 11.38,92.12 11.38,101.38 12.12,102.12 U$1.9 12.25,102.25 12.25,104.75 U$1.10
N$14
  Top 0.152: R19.1 27.38,96.12 25.5,96.12 25.12,96.5 B1.LEDNEG
N$15
  Top 0.152: R18.1 2.12,93.12 5.38,93.12 5.75,92.75 MODELED2.K
N$16
  Top 0.152: R20.1 2.12,85.5 5.38,85.5 5.75,85.12 MODELED3.K
N$17
  Top 0.152: R21.1 2.12,100.62 5.5,100.62 5.75,100.38 MODELED1.K
N$19
  Top 0.152: R11.1 27.38,73.25 25.5,73.25 25.12,73.62 B4.LEDNEG
N$20
  Top 0.152: R12.1 27.38,65.62 25.5,65.62 25.12,66 B5.LEDNEG
N$21
  Top 0.152: R13.1 27.38,58 25.5,58 25.12,58.38 B6.LEDNEG
N$22
  Top 0.152: R14.1 27.38,50.5 25.38,50.5 25.12,50.75 B7.LEDNEG
N$23
  Top 0.152: R15.1 27.38,42.88 25.38,42.88 25.12,43.12 B8.LEDNEG
N$43  (via drill 0.3)
  Top 0.152: R67.1 2,37.12 2,28 1.38,27.38 1.38,20.75 v5.25,16.88 7,15.12 CLOCK.TIP@2
  Bottom 0.152: v5.25,16.88 7,15.12 CLOCK.TIP@2
N$66
  Top 0.152: R67.2 2.12,39 2.12,41.88 2.25,42 Q2.B
PTA1  (via drill 0.3)
  Top 0.152: v8.38,60.12 8.38,56.88 U1.23
  Bottom 0.152: v8.38,60.12 9.5,61.25 9.5,61.75 9,62.25 6.75,62.25 SWD1.10
RESET  (via drill 0.3)
  Top 0.152: Q1.C 8.5,44.38 9.12,45 9.12,46.25 R3.1 9.25,46.38 9.25,47.62 9,47.88 v9,48.62 | v8.12,49.5 8.12,51.5 8.25,51.62 8.25,52.38 U1.8
  Bottom 0.152: v9,48.62 v8.12,49.5
RX  (via drill 0.3)
  Top 0.152: v11.12,56.5 11.12,55.88 U1.18 | v7.12,52.5 6.88,52.5 6.75,52.62 6.25,52.62 v5.62,52 | v4.38,52 2.62,52 0.88,53.75 0.88,64.25 1.38,64.75 v1.38,68.12 | v2.25,69 1.5,69.75 1.5,76.38 2.75,77.62 2.75,79.5 1.62,80.62 SERIAL.2
  Bottom 0.152: v7.12,52.5 v11.12,56.5 | v4.38,52 v5.62,52 | v2.25,69 v1.38,68.12
TRIG  (via drill 0.3)
  Top 0.152: v6.12,47.12 6.12,38.5 6.5,38.12 7.62,38.12 8,37.75 8,34.62 16.62,26 16.62,25.62 R4.1 | v6.12,49.12 6.12,50.62 7.88,52.38 U1.7
  Bottom 0.152: v6.12,49.12 v6.12,47.12
TRIGGEROUT  (via drill 0.3)
  Top 0.152: Q3.C 18.5,20.25 18.62,20.12 21,20.12 R5.1 21.12,20 21.12,16.88 | 21.12,16.88 21.12,16.25 22.25,15.12 GATE.TIP@2 | 21.12,16.88 v22.25,16.88
  Bottom 0.152: v22.25,16.88 22.25,15.12 GATE.TIP@2
TX  (via drill 0.3)
  Top 0.152: v9.62,59.12 10.38,59.12 10.88,58.62 10.88,57.75 12.12,56.5 12.12,55.62 11.88,55.38 11.25,55.38 U1.17 | v8.12,64.12 6.25,64.12 1.12,69.25 1.12,77.62 1.5,78 SERIAL.1
  Bottom 0.152: v9.62,59.12 9.62,60.38 10.25,61 10.25,62 v8.12,64.12